# EasyEDA Pro project 农装_2025-08-27.epro, board PCB3_2
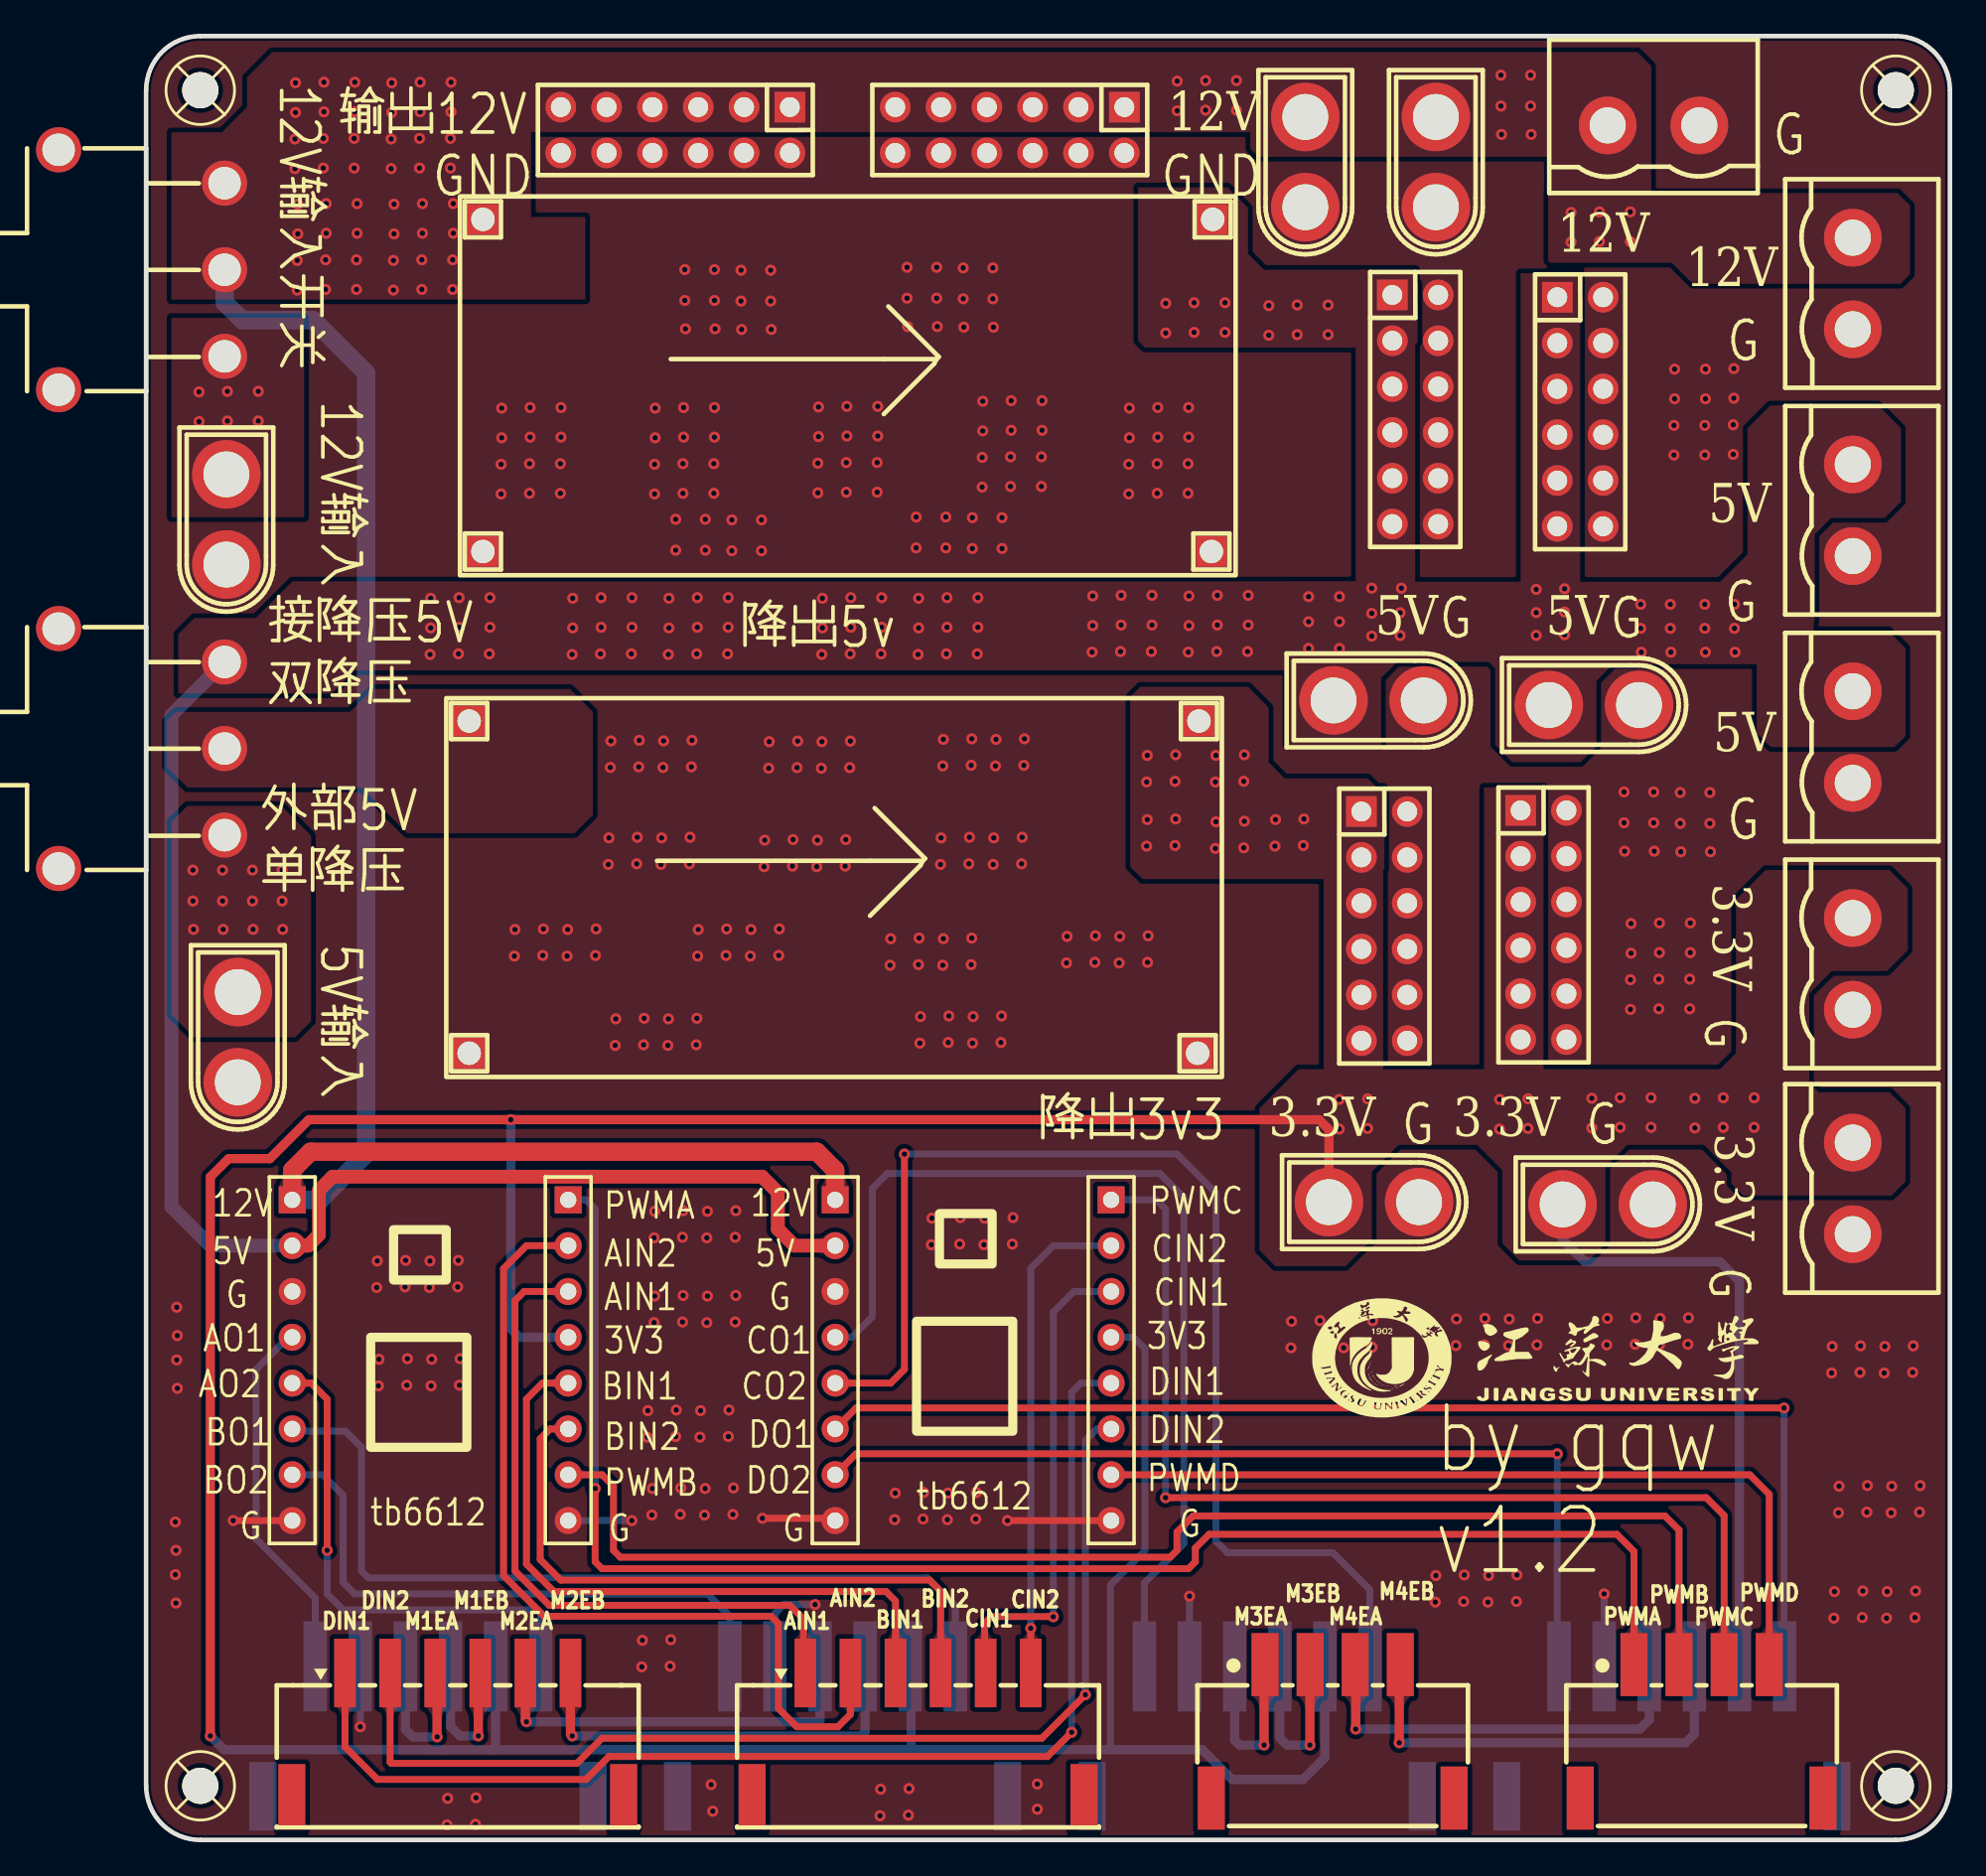
[diagram p4: board, top side]
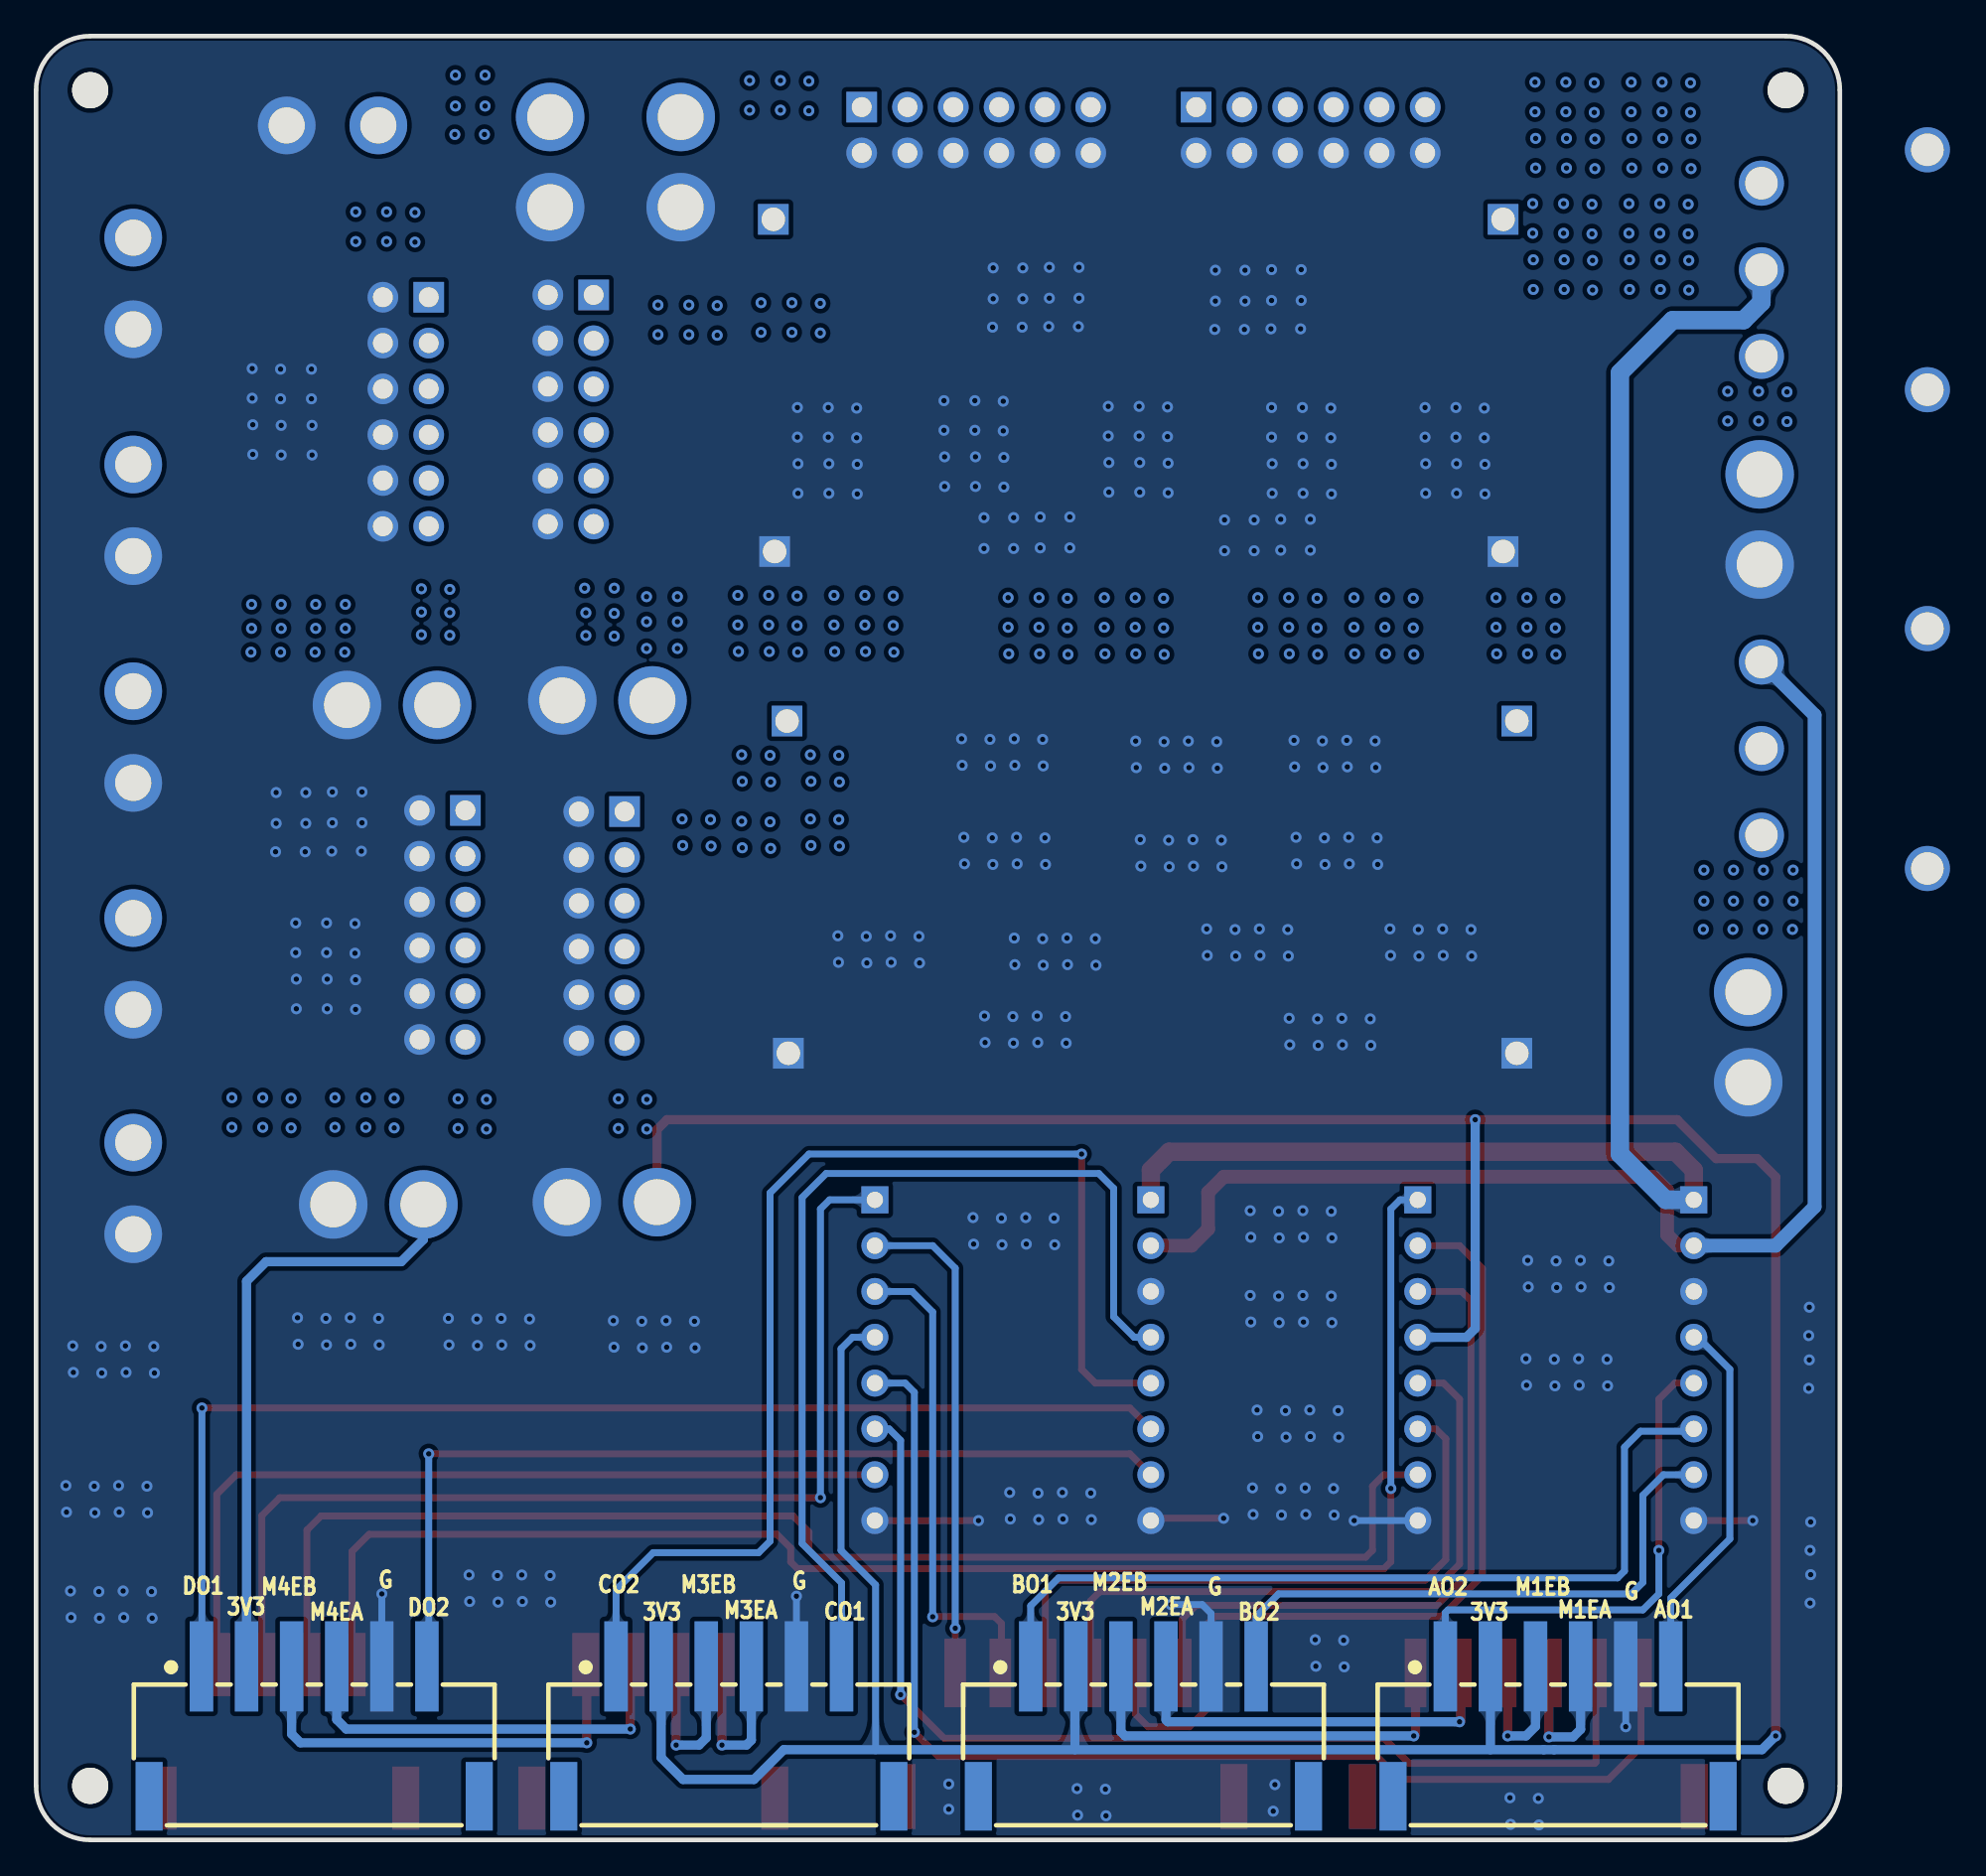
[diagram p5: board, bottom side, seen from below]

Outline 100 x 100 mm; copper layers: Top Layer, Bottom Layer. Coordinates in mm from the lower left corner of the outline.
Outline path: 0,97 0,3 arc(0.88,0.88) 3,0 97,0 arc(99.12,0.88) 100,3 100,97 arc(99.12,99.12) 97,100 3,100 arc(0.88,99.12) 0,97
Stack: Top Layer 0.035mm / Dielectric1 1.51mm FR4 er 4.5 / Bottom Layer 0.035mm

## Design rules (mm)
template: 自定义配置
spacing copperThickness1oz (default): track to track 0.102, other pairs 0.152 to 0.3
spacing copperThickness2oz: track to track 0.203, other pairs 0.152 to 0.3
track width copperThickness1oz (default): min 0.127, default 0.381, max 2.54
track width copperThickness2oz: min 0.203, default 0.254, max 2.54
differential pair differentialPair (default): width min 0.127, default 0.254, max 2.54; gap min 0.152, default 0.152
via viaSize (default): diameter min 0.5, default 0.61, max 10; hole min 0.3, default 0.305, max 6.299

## Placement (name value [footprint] x y rotation side)
CN1  XT30U-M  [CONN-TH_XT30U-M]  4.44 73.2 270 top
CN3  XT30U-M  [CONN-TH_XT30U-M]  5.08 44.5 270 top
CN16  WAFER-XH2.54-4PWB  [CONN-TH_4P-P0.20_XUNPU_WAFER-XH2.54-4PWB]  86.23 6.02 0 top
CN49  DB2EVC-5.08-2P-GN  [CONN-TH_2P-P5.08_DB2EVC-5.08-2P]  94.62 73.71 90 top
CN50  DB2EVC-5.08-2P-GN  [CONN-TH_2P-P5.08_DB2EVC-5.08-2P]  94.62 36.12 90 top
CN51  XT30U-M  [CONN-TH_XT30U-M]  64.26 93.02 270 top
CN52  XT30U-M  [CONN-TH_XT30U-M]  71.5 93.02 270 top
CN53  DB2EVC-5.08-2P-GN  [CONN-TH_2P-P5.08_DB2EVC-5.08-2P]  83.57 95.05 180 top
CN54  DB2EVC-5.08-2P-GN  [CONN-TH_2P-P5.08_DB2EVC-5.08-2P]  94.62 86.28 90 top
CN55  DB2EVC-5.08-2P-GN  [CONN-TH_2P-P5.08_DB2EVC-5.08-2P]  94.62 48.56 90 top
CN56  DB2EVC-5.08-2P-GN  [CONN-TH_2P-P5.08_DB2EVC-5.08-2P]  94.62 61.14 90 top
CN57  XT30U-M  [CONN-TH_XT30U-M]  68.33 63.17 0 top
CN58  XT30U-M  [CONN-TH_XT30U-M]  80.26 62.92 0 top
CN59  XT30U-M  [CONN-TH_XT30U-M]  68.07 35.36 0 top
CN60  XT30U-M  [CONN-TH_XT30U-M]  81.03 35.23 0 top
CN61  WAFER-XH2.54-4PWB  [CONN-TH_4P-P0.20_XUNPU_WAFER-XH2.54-4PWB]  65.78 6.02 0 top
P1  双排针2.54mm2*6排针  [HDR-TH_12P-P2.54-V-M-R2-C6-S2.54]  79.5 79.17 270 top
P2  双排针2.54mm2*6排针  [HDR-TH_12P-P2.54-V-M-R2-C6-S2.54]  68.64 50.66 270 top
P3  双排针2.54mm2*6排针  [HDR-TH_12P-P2.54-V-M-R2-C6-S2.54]  29.34 94.79 180 top
P4  双排针2.54mm2*6排针  [HDR-TH_12P-P2.54-V-M-R2-C6-S2.54]  47.88 94.79 180 top
P5  双排针2.54mm2*6排针  [HDR-TH_12P-P2.54-V-M-R2-C6-S2.54]  70.36 79.3 270 top
P6  双排针2.54mm2*6排针  [HDR-TH_12P-P2.54-V-M-R2-C6-S2.54]  77.47 50.72 270 top
SCREW1  -  [M2螺丝]  97 3 0 top
SCREW2  -  [M2螺丝]  3 3 0 top
SCREW3  -  [M2螺丝]  97 97 0 top
SCREW4  -  [M2螺丝]  3 97 0 top
SW1  SS-12D11L5  [SW-TH_SS-12D11L5]  -0.25 87.05 90 top
SW2  SS-12D11L5  [SW-TH_SS-12D11L5]  -0.25 60.5 90 top
TB1  TB6612  [tb6612]  45.85 26.59 0 top
TB2  TB6612  [tb6612]  15.75 26.59 0 top
U2  -  [lm2596s模块]  38.86 82.09 0 top
U3  -  [lm2596s模块]  38.1 54.28 0 top
U6  HX 2.54-6P WT  [CONN-SMD_6P-P2.50_HANXIA_HX-2.54-6P-WT]  84.58 6.02 180 bottom
U11  2.54-6PWT  [COMM-SMD_6P-P2.50_SHOUHAN_2.54-6PWT]  42.79 5.83 0 top
U28  HX 2.54-6P WT  [CONN-SMD_6P-P2.50_HANXIA_HX-2.54-6P-WT]  61.59 6.02 180 bottom
U32  HX 2.54-6P WT  [CONN-SMD_6P-P2.50_HANXIA_HX-2.54-6P-WT]  15.62 6.02 180 bottom
U33  HX 2.54-6P WT  [CONN-SMD_6P-P2.50_HANXIA_HX-2.54-6P-WT]  38.61 6.02 180 bottom
U34  2.54-6PWT  [COMM-SMD_6P-P2.50_SHOUHAN_2.54-6PWT]  17.27 5.83 0 top

## Footprints (pads in the part's own frame, mm; a bottom-side part is the same pattern mirrored in y, then rotated)
COMM-SMD_6P-P2.50_SHOUHAN_2.54-6PWT
  rect 1.2x3.8 smd: 1(-6.25,3.425) 2(-3.75,3.425) 3(-1.25,3.425) 4(1.25,3.425) 5(3.75,3.425) 6(6.25,3.425)
  rect 1.5x3.6 smd: 7(9.2,-3.425) 8(-9.2,-3.425)
CONN-SMD_6P-P2.50_HANXIA_HX-2.54-6P-WT
  rect 1.3x5 smd: 1(-6.25,3.6) 2(-3.75,3.6) 3(-1.25,3.6) 4(1.25,3.6) 5(3.75,3.6) 6(6.25,3.6)
  rect 1.5x3.8 smd: 7(-9.15,-3.6) 8(9.15,-3.6)
CONN-TH_2P-P5.08_DB2EVC-5.08-2P
  round 3.2 hole 2: 1(-2.54,0) 2(2.54,0)
CONN-TH_4P-P0.20_XUNPU_WAFER-XH2.54-4PWB
  rect 1.5x3.5 smd: 1(-3.75,3.7) 2(-1.25,3.7) 3(1.25,3.7) 4(3.75,3.7) 5(-6.73,-3.7) 6(6.73,-3.7)
CONN-TH_XT30U-M
  round 3.8 hole 2.54: 1(-2.5,0) 2(2.5,0)
HDR-TH_12P-P2.54-V-M-R2-C6-S2.54
  rect 1.7x1.7 hole 1.1: 1(-6.35,-1.27)
  round 1.7 hole 1.1: 2(-6.35,1.27) 3(-3.81,-1.27) 4(-3.81,1.27) 5(-1.27,-1.27) 6(-1.27,1.27) 7(1.27,-1.27) 8(1.27,1.27) 9(3.81,-1.27) 10(3.81,1.27) 11(6.35,-1.27) 12(6.35,1.27)
lm2596s模块
  rect 1.7x1.7 hole 1.3: 1(-20.193,7.747) 2(-20.193,-10.668) 3(20.266,7.747) 4(20.193,-10.668)
M2螺丝
  round 2 hole 2: 1(0,0)
SW-TH_SS-12D11L5
  round 2.5 hole 1.8: 1(-4.8,-4.6) 2(0,-4.6) 3(4.8,-4.6) 4(-6.65,4.6) 5(6.65,4.6)
tb6612
  rect 1.5x1.5 hole 0.9: 1(-7.65,8.89) 2(7.65,8.89)
  round 1.5 hole 0.9: 3(-7.65,6.35) 4(7.65,6.35) 5(-7.65,3.81) 6(7.65,3.81) 7(-7.65,1.27) 8(7.65,1.27) 9(-7.65,-1.27) 10(7.65,-1.27) 11(-7.65,-3.81) 12(7.65,-3.81) 13(-7.65,-6.35) 14(7.65,-6.35) 15(-7.65,-8.89) 16(7.65,-8.89)

## Nets
3V3: CN50.2 CN55.2 CN59.1 CN60.1 P2.1 P2.3 P2.5 P2.7 P2.9 P2.11 P6.1 P6.3 P6.5 P6.7 P6.9 P6.11 TB1.8 TB2.8 U3.3 U6.2 U28.2 U32.2 U33.2
5V: CN49.2 CN56.2 CN57.1 CN58.1 P1.1 P1.3 P1.5 P1.7 P1.9 P1.11 P5.1 P5.3 P5.5 P5.7 P5.9 P5.11 SW2.3 TB1.3 TB2.3 U2.3
12V: CN51.1 CN52.1 CN53.2 CN54.2 P3.1 P3.3 P3.5 P3.7 P3.9 P3.11 P4.1 P4.3 P4.5 P4.7 P4.9 P4.11 SW1.2 SW1.3 TB1.1 TB2.1 U2.1
GND: CN1.2 CN3.2 CN49.1 CN50.1 CN51.2 CN52.2 CN53.1 CN54.1 CN55.1 CN56.1 CN57.2 CN58.2 CN59.2 CN60.2 P1.2 P1.4 P1.6 P1.8 P1.10 P1.12 P2.2 P2.4 P2.6 P2.8 P2.10 P2.12 P3.2 P3.4 P3.6 P3.8 P3.10 P3.12 P4.2 P4.4 P4.6 P4.8 P4.10 P4.12 P5.2 P5.4 P5.6 P5.8 P5.10 P5.12 P6.2 P6.4 P6.6 P6.8 P6.10 P6.12 TB1.5 TB1.15 TB1.16 TB2.5 TB2.15 TB2.16 U2.2 U2.4 U3.2 U3.4 U6.5 U28.5 U32.5 U33.5
AIN1: TB2.6 U11.1
AIN2: TB2.4 U11.2
AO1: TB2.7 U32.6
AO2: TB2.9 U32.1
BIN1: TB2.10 U11.3
BIN2: TB2.12 U11.4
BO1: TB2.11 U33.1
BO2: TB2.13 U33.6
CIN1: TB1.6 U11.5
CIN2: TB1.4 U11.6
CO1: TB1.7 U28.6
CO2: TB1.9 U28.1
DIN1: TB1.10 U34.1
DIN2: TB1.12 U34.2
DO1: TB1.11 U6.1
DO2: TB1.13 U6.6
M1_ENCODER_A: U32.4 U34.3
M1_ENCODER_B: U32.3 U34.4
M2_ENCODER_A: U33.4 U34.5
M2_ENCODER_B: U33.3 U34.6
M3_ENCODER_A: CN61.1 U28.4
M3_ENCODER_B: CN61.2 U28.3
M4_ENCODER_A: CN61.3 U6.4
M4_ENCODER_B: CN61.4 U6.3
PWMA: CN16.1 TB2.2
PWMB: CN16.2 TB2.14
PWMC: CN16.3 TB1.2
PWMD: CN16.4 TB1.14
$1N1529: CN1.1 SW1.1
$1N4066: CN3.1 SW2.1
$1N4071: SW2.2 U3.1

Pads without a net: CN16 5 6; CN61 5 6; SCREW1 1; SCREW2 1; SCREW3 1; SCREW4 1; SW1 4 5; SW2 4 5; U6 7 8; U11 7 8; U28 7 8; U32 7 8; U33 7 8; U34 7 8

## Via types
v1: diameter 0.61, hole 0.305, Top Layer to Bottom Layer, 633 vias

## Routing (per net, layer and track width the routed paths; a pad name or vN(x,y) marks a point on that pad's centre or on a via; arc(x,y) is an arc through that point)
3V3: length 250.4
  Top Layer w0.508: v1(3.56,5.77) 3.56,36.75 4.57,37.77 6.86,37.77 9.02,39.93 65.02,39.93 65.57,39.38 CN59.1
  Bottom Layer w0.381: 53.46,5 53.46,14.14 55.37,16.05 55.37,27.23 54.74,27.86 TB1.8
  Bottom Layer w0.508: 19.37,5 16.43,5 16.42,5 15.83,5 15.83,5 4.32,5 v1(3.56,5.77) ; 19.37,5 U32.2 ; 19.37,5 42.41,5 ; TB2.8 20.7,27.86 20.22,28.35 v1(20.22,39.93) ; U6.2 88.33,30.97 87.25,32.06 79.76,32.06 78.53,33.28 CN60.1 ; U28.2 65.34,4.56 64.13,3.35 60.2,3.35 58.55,5 42.41,5 ; 42.41,5 42.41,9.57 U33.2
  vias: v1(55.5,60.12) v1(55.47,58.65) v1(55.5,56.57) v1(55.47,55.09) v1(57.04,58.68) v1(57.04,55.13) v1(57.07,60.16) v1(57.07,56.6) v1(59.31,60.12) v1(59.28,58.65) v1(59.31,56.44) v1(59.28,54.97) v1(60.85,58.68) v1(60.85,55) v1(60.88,60.16) v1(60.88,56.47) v1(62.61,56.57) v1(62.58,55.09) v1(64.19,56.6) v1(64.15,55.13) v1(66.14,41.05) v1(66.14,39.41) v1(67.72,41.09) v1(67.72,39.44) v1(75.03,41.05) v1(75.03,39.41) v1(76.61,41.09) v1(76.61,39.44) v1(80.15,41.11) v1(80.15,39.47) v1(81.72,41.15) v1(81.72,39.5) v1(83.43,41.15) v1(83.43,39.5) v1(85.86,41.11) v1(85.86,39.47) v1(87.43,41.15) v1(87.43,39.5) v1(89.15,41.15) v1(89.15,39.5)
5V: length 74.9
  Top Layer w0.762: TB2.3 8.97,32.94 9.57,33.55 9.57,36.01 10.34,36.77 34.15,36.77 35.02,35.9 35.02,33.86 35.94,32.94 TB1.3
  Bottom Layer w0.762: SW2.3 1.4,62.35 1.4,35.1 3.56,32.94 TB2.3
  vias: v1(15.74,65.72) v1(15.77,68.83) v1(15.77,67.19) v1(17.35,68.87) v1(17.35,67.22) v1(17.31,65.75) v1(19.03,65.75) v1(19.06,68.87) v1(19.06,67.22) v1(23.65,68.83) v1(23.65,67.19) v1(23.61,65.72) v1(25.22,68.87) v1(25.22,67.22) v1(25.19,65.75) v1(26.93,68.87) v1(26.93,67.22) v1(26.9,65.75) v1(28.95,65.72) v1(28.98,68.83) v1(28.98,67.19) v1(30.52,65.75) v1(30.56,68.87) v1(30.56,67.22) v1(32.23,65.75) v1(32.27,68.87) v1(32.27,67.22) v1(37.49,68.83) v1(37.49,67.19) v1(37.46,65.72) v1(39.03,65.75) v1(39.06,68.87) v1(39.06,67.22) v1(40.74,65.75) v1(40.78,68.87) v1(40.78,67.22) v1(42.82,68.83) v1(42.82,67.19) v1(42.79,65.72) v1(44.4,68.87) v1(44.4,67.22) v1(44.36,65.75) v1(46.11,68.87) v1(46.11,67.22) v1(46.08,65.75) v1(52.44,65.85) v1(52.48,68.96) v1(52.48,67.32) v1(54.02,65.88) v1(54.05,69) v1(54.05,67.35) v1(55.73,65.88) v1(55.76,69) v1(55.76,67.35) v1(56.52,85.18) v1(56.52,83.54) v1(57.81,68.96) v1(57.81,67.32) v1(57.78,65.85) v1(58.1,85.22) v1(58.1,83.57) v1(59.38,69) v1(59.38,67.35) v1(59.35,65.88) v1(59.81,85.22) v1(59.81,83.57) v1(61.1,69) v1(61.1,67.35) v1(61.06,65.88) v1(62.24,85.06) v1(62.24,83.41) v1(63.81,85.09) v1(63.81,83.45) v1(64.44,68.92) v1(64.44,67.53) v1(64.44,66.05) v1(65.52,85.09) v1(65.52,83.45) v1(66.16,68.92) v1(66.16,67.53) v1(66.16,66.05) v1(67.94,69.39) v1(67.94,68) v1(67.94,66.73) v1(69.52,68.03) v1(69.52,66.77) v1(69.59,69.39) v1(77.06,69.33) v1(77.06,68.04) v1(77.06,66.78) v1(78.64,69.36) v1(78.64,68.07) v1(78.64,66.81) v1(82.85,68.5) v1(82.85,67.17) v1(82.89,65.85) v1(84.5,68.5) v1(84.5,67.17) v1(84.53,65.85) v1(86.41,68.5) v1(86.41,67.17) v1(86.44,65.85) v1(88.05,68.5) v1(88.05,67.17) v1(88.09,65.85)
12V: length 94
  Top Layer w1.016: TB2.1 8.1,37.14 9.11,38.15 37.18,38.15 38.2,37.14 TB1.1
  Bottom Layer w1.016: SW1.2 4.35,85.24 5.33,84.25 9.27,84.25 12.19,81.33 12.19,38.02 9.65,35.48 TB2.1
  vias: v1(8.25,94.29) v1(8.25,92.65) v1(8.28,97.41) v1(8.28,95.77) v1(8.41,90.68) v1(8.41,89.03) v1(8.37,87.56) v1(8.37,85.92) v1(9.82,94.33) v1(9.82,92.68) v1(9.85,97.44) v1(9.85,95.8) v1(9.95,87.6) v1(9.95,85.95) v1(9.98,90.71) v1(9.98,89.07) v1(11.53,94.33) v1(11.53,92.68) v1(11.57,97.44) v1(11.57,95.8) v1(11.69,90.71) v1(11.69,89.07) v1(11.66,87.6) v1(11.66,85.95) v1(13.61,97.41) v1(13.61,95.77) v1(13.58,94.29) v1(13.58,92.65) v1(13.74,90.68) v1(13.74,89.03) v1(13.71,87.56) v1(13.71,85.92) v1(15.19,97.44) v1(15.19,95.8) v1(15.15,94.33) v1(15.15,92.68) v1(15.31,90.71) v1(15.31,89.07) v1(15.28,87.6) v1(15.28,85.95) v1(16.9,97.44) v1(16.9,95.8) v1(16.87,94.33) v1(16.87,92.68) v1(17.03,90.71) v1(17.03,89.07) v1(16.99,87.6) v1(16.99,85.95) v1(57.16,97.5) v1(57.16,95.86) v1(58.73,97.54) v1(58.73,95.89) v1(60.44,97.54) v1(60.44,95.89) v1(75.11,97.83) v1(75.11,96.12) v1(75.14,94.55) v1(76.75,97.83) v1(76.75,96.12) v1(76.78,94.55) v1(78.99,90.22) v1(78.99,88.58) v1(80.57,90.25) v1(80.57,88.61) v1(82.28,90.25) v1(82.28,88.61)
GND: length 33.3
  Top Layer w0.381: v1(34.16,17.83) 38.07,17.83 TB1.15 ; TB1.16 v1(47.75,17.7) ; TB2.15 v1(4.83,17.7)
  Bottom Layer w0.381: U32.5 v1(11.87,6.27) ; U28.5 v1(57.84,13.51) ; U33.5 34.86,12.56 35.35,13.05 v1(37.08,13.05) ; U6.5 v1(80.83,13.64) ; TB2.16 v1(26.92,17.7)
  vias: v1(1.62,17.63) v1(1.62,14.71) v1(1.69,29.53) v1(1.73,27.96) v1(1.69,26.61) v1(1.73,25.04) v1(1.65,16.05) v1(1.65,13.13) v1(12.81,32.1) v1(12.78,30.62) v1(12.91,26.65) v1(12.87,25.17) v1(14.38,32.13) v1(14.35,30.66) v1(14.45,25.21) v1(14.48,26.68) v1(15.73,32.1) v1(15.7,30.62) v1(15.83,26.65) v1(15.8,25.17) v1(16.71,2.3) v1(16.68,0.83) v1(17.31,32.13) v1(17.27,30.66) v1(17.4,26.68) v1(17.37,25.21) v1(18.29,2.34) v1(18.25,0.87) v1(19.71,79.38) v1(19.71,77.73) v1(19.68,76.26) v1(19.68,74.62) v1(20.45,50.47) v1(20.41,49) v1(21.28,79.41) v1(21.28,77.77) v1(21.25,76.29) v1(21.25,74.65) v1(22.02,50.5) v1(21.99,49.03) v1(23,79.41) v1(23,77.77) v1(22.96,76.29) v1(22.96,74.65) v1(23.33,49) v1(23.37,50.47) v1(24.94,50.5) v1(24.91,49.03) v1(25.62,54.08) v1(25.73,59.45) v1(25.65,55.55) v1(25.76,60.92) v1(26.03,45.52) v1(26,44.05) v1(27.23,55.58) v1(27.19,54.11) v1(27.34,60.96) v1(27.31,59.49) v1(27.51,11.07) v1(27.48,9.59) v1(27.61,45.55) v1(27.58,44.08) v1(27.81,23.8) v1(27.78,22.33) v1(28.03,18.01) v1(28.07,19.48) v1(28.22,79.38) v1(28.22,77.73) v1(28.19,76.26) v1(28.19,74.62) v1(28.19,34.85) v1(28.16,33.38) v1(28.19,30.15) v1(28.16,28.68) v1(28.54,54.08) v1(28.57,55.55) v1(28.69,60.92) v1(28.65,59.45) v1(28.92,44.05) v1(28.96,45.52) v1(29.05,9.63) v1(29.08,11.1) v1(29.35,73.21) v1(29.35,71.5) v1(29.39,23.83) v1(29.35,22.36) v1(29.64,19.52) v1(29.61,18.04) v1(29.73,33.41) v1(29.73,28.71) v1(29.79,79.41) v1(29.79,77.77) v1(29.76,76.29) v1(29.76,74.65) v1(29.77,34.88) v1(29.77,30.18) v1(29.86,87.05) v1(29.86,85.34) v1(29.9,83.77) v1(30.15,55.58) v1(30.12,54.11) v1(30.23,59.49) v1(30.26,60.96) v1(30.53,45.55) v1(30.5,44.08) v1(30.61,50.47) v1(30.57,49) v1(30.73,23.8) v1(30.7,22.33) v1(31,73.21) v1(31,71.5) v1(30.99,19.48) v1(30.95,18.01) v1(31.12,34.85) v1(31.08,33.38) v1(31.12,30.15) v1(31.08,28.68) v1(31.32,3.07) v1(31.41,1.59) v1(31.5,87.05) v1(31.5,85.34) v1(31.54,83.77) v1(31.5,79.41) v1(31.5,77.77) v1(31.47,76.29) v1(31.47,74.65) v1(32.15,49.03) v1(32.18,50.5) v1(32.31,23.83) v1(32.27,22.36) v1(32.47,73.18) v1(32.47,71.47) v1(32.53,18.04) v1(32.56,19.52) v1(32.69,34.88) v1(32.66,33.41) v1(32.69,30.18) v1(32.66,28.71) v1(32.98,87.02) v1(32.98,85.31) v1(33.01,83.74) v1(33.53,50.47) v1(33.49,49) v1(34.11,73.18) v1(34.11,71.47) v1(34.29,55.42) v1(34.26,53.95) v1(34.54,60.88) v1(34.51,59.41) v1(34.62,87.02) v1(34.62,85.31) v1(34.65,83.74) v1(35.1,50.5) v1(35.07,49.03) v1(35.83,53.98) v1(35.86,55.46) v1(36.12,60.92) v1(36.08,59.45) v1(37.24,76.32) v1(37.24,74.68) v1(37.21,55.42) v1(37.18,53.95) v1(37.27,79.44) v1(37.27,77.8) v1(37.43,59.41) v1(37.47,60.88) v1(38.85,79.47) v1(38.85,77.83) v1(38.81,76.36) v1(38.81,74.71) v1(38.78,55.46) v1(38.75,53.98) v1(39.04,60.92) v1(39.01,59.45) v1(40.53,76.36) v1(40.53,74.71) v1(40.56,79.47) v1(40.56,77.83) v1(40.72,2.81) v1(40.68,1.34) v1(41.24,48.49) v1(41.28,49.96) v1(41.53,19.23) v1(41.5,17.76) v1(42.18,87.18) v1(42.18,85.47) v1(42.21,83.9) v1(42.29,2.84) v1(42.26,1.37) v1(42.69,73.34) v1(42.69,71.63) v1(42.85,50) v1(42.82,48.52) v1(42.93,45.64) v1(42.89,44.17) v1(43.1,19.26) v1(43.07,17.79) v1(43.53,33) v1(43.56,34.47) v1(43.82,87.18) v1(43.82,85.47) v1(43.86,83.9) v1(44.04,54.08) v1(44.07,55.55) v1(44.2,61.01) v1(44.16,59.54) v1(44.2,49.96) v1(44.16,48.49) v1(44.33,73.34) v1(44.33,71.63) v1(44.45,19.23) v1(44.42,17.76) v1(44.5,45.68) v1(44.47,44.21) v1(45.13,34.5) v1(45.1,33.03) v1(45.3,87.15) v1(45.3,85.44) v1(45.33,83.86) v1(45.64,55.58) v1(45.61,54.11) v1(45.74,59.57) v1(45.74,48.52) v1(45.8,73.31) v1(45.8,71.59) v1(45.77,61.04) v1(45.77,50) v1(45.85,45.64) v1(45.81,44.17) v1(46.02,19.26) v1(45.99,17.79) v1(46.35,76.64) v1(46.35,75) v1(46.38,79.76) v1(46.38,78.11) v1(46.45,33) v1(46.48,34.47) v1(46.94,87.15) v1(46.94,85.44) v1(46.97,83.86) v1(46.99,55.55) v1(46.96,54.08) v1(47.12,61.01) v1(47.08,59.54) v1(47.45,73.31) v1(47.45,71.59) v1(47.42,45.68) v1(47.39,44.21) v1(47.92,76.67) v1(47.92,75.03) v1(47.95,79.79) v1(47.95,78.15) v1(48.02,33.03) v1(48.06,34.5) v1(48.53,54.11) v1(48.56,55.58) v1(48.69,61.04) v1(48.66,59.57) v1(49.4,3.1) v1(49.4,1.7) v1(49.63,76.67) v1(49.63,75.03) v1(49.67,79.79) v1(49.67,78.15) v1(51.02,48.62) v1(51.05,50.09) v1(52.63,50.12) v1(52.59,48.65) v1(53.94,48.62) v1(53.97,50.09) v1(54.51,79.38) v1(54.51,77.73) v1(54.47,76.26) v1(54.47,74.62) v1(55.55,50.12) v1(55.52,48.65) v1(56.05,76.29) v1(56.05,74.65) v1(56.08,79.41) v1(56.08,77.77) v1(57.79,79.41) v1(57.79,77.77) v1(57.76,76.29) v1(57.76,74.65) v1(63.5,28.75) v1(63.47,27.28) v1(65.04,27.31) v1(65.07,28.79) v1(66.42,28.75) v1(66.39,27.28) v1(68,28.79) v1(67.96,27.31) v1(71.5,14.66) v1(71.47,13.18) v1(72.64,28.88) v1(72.61,27.41) v1(73.04,13.22) v1(73.07,14.69) v1(74.22,28.91) v1(74.18,27.44) v1(74.42,14.66) v1(74.39,13.18) v1(75.53,27.41) v1(75.56,28.88) v1(76,14.69) v1(75.96,13.22) v1(77.14,28.91) v1(77.11,27.44) v1(81.01,28.91) v1(80.98,27.44) v1(81.93,58.1) v1(81.93,56.39) v1(81.97,54.81) v1(82.32,50.8) v1(82.32,49.16) v1(82.29,47.69) v1(82.29,46.04) v1(82.58,28.95) v1(82.55,27.48) v1(83.57,58.1) v1(83.57,56.39) v1(83.61,54.81) v1(83.9,50.83) v1(83.9,49.19) v1(83.86,47.72) v1(83.86,46.08) v1(83.93,28.91) v1(83.9,27.44) v1(84.73,81.53) v1(84.73,79.89) v1(84.7,78.42) v1(84.7,76.78) v1(85.05,58.06) v1(85.05,56.35) v1(85.08,54.78) v1(85.51,28.95) v1(85.47,27.48) v1(85.61,50.83) v1(85.61,49.19) v1(85.57,47.72) v1(85.57,46.08) v1(86.45,81.53) v1(86.45,79.89) v1(86.41,78.42) v1(86.41,76.78) v1(86.69,58.06) v1(86.69,56.35) v1(86.72,54.78) v1(88.02,81.57) v1(88.02,79.92) v1(87.99,78.45) v1(87.99,76.81) v1(93.44,25.88) v1(93.47,27.36) v1(93.6,13.77) v1(93.57,12.29) v1(93.82,18.14) v1(93.85,19.61) v1(95.05,27.39) v1(95.01,25.92) v1(95.14,12.33) v1(95.17,13.8) v1(95.43,19.64) v1(95.39,18.17) v1(96.39,27.36) v1(96.36,25.88) v1(96.52,13.77) v1(96.49,12.29) v1(96.74,18.14) v1(96.77,19.61) v1(97.93,25.92) v1(97.97,27.39) v1(98.09,13.8) v1(98.06,12.33) v1(98.35,19.64) v1(98.31,18.17)
AIN1: length 38.3
  Top Layer w0.381: TB2.6 20.95,30.4 20.45,29.9 20.45,14.91 22.35,13 35.69,13 36.45,12.24 36.45,9.35 U11.1
AIN2: length 49.2
  Top Layer w0.381: U11.2 39.04,6.96 38.35,6.27 36.07,6.27 35.05,7.29 35.05,11.99 34.64,12.4 22.07,12.4 19.81,14.66 19.81,31.67 21.08,32.94 TB2.4
AO1: length 20.6
  Bottom Layer w0.381: TB2.7 7.87,27.86 6.1,26.09 6.1,16.69 9.37,13.41 U32.6
AO2: length 28.3
  Top Layer w0.381: TB2.9 9.14,25.32 10.03,24.44 v1(10.03,16.05)
  Bottom Layer w0.381: v1(10.03,16.05) 10.03,13.64 10.92,12.75 21.72,12.75 21.87,12.6 U32.1
BIN1: length 37.1
  Top Layer w0.381: TB2.10 21.97,25.32 21.08,24.44 21.08,15.29 22.61,13.77 41.02,13.77 41.54,13.25 U11.3
BIN2: length 35.9
  Top Layer w0.381: TB2.12 22.39,22.78 21.84,22.23 21.84,15.54 22.99,14.4 43.43,14.4 44.04,13.79 U11.4
BO1: length 48.2
  Bottom Layer w0.381: U33.1 44.86,12.98 43.31,14.53 12.32,14.53 11.94,14.91 11.94,21.77 11.05,22.66 8.22,22.66 TB2.11
BO2: length 33.1
  Bottom Layer w0.381: U33.6 32.36,12.4 31.12,13.64 11.56,13.64 10.92,14.28 10.92,19.1 9.78,20.24 TB2.13
CIN1: length 27.3
  Top Layer w0.381: v1(50.29,12.37) 50.28,12.38 46.86,12.38 46.48,12 46.48,9.31 U11.5
  Bottom Layer w0.381: TB1.6 51.44,30.4 50.29,29.26 v1(50.29,12.37)
CIN2: length 27.4
  Top Layer w0.381: U11.6 v1(49.04,11.74)
  Bottom Layer w0.381: TB1.4 50.29,32.94 49.04,31.69 v1(49.04,11.74)
CO1: length 54.7
  Bottom Layer w0.381: TB1.7 39.12,27.86 40.26,29.01 40.26,36.12 41.08,36.94 56.2,36.94 57.53,35.61 57.53,16.43 55.34,14.25 U28.6
CO2: length 67.5
  Top Layer w0.381: v1(42.04,38.02) 42.04,26.09 41.28,25.32 TB1.9
  Bottom Layer w0.381: U28.1 67.84,13.87 65.79,15.93 59.94,15.93 59.31,16.56 59.31,35.86 57.15,38.02 v1(42.04,38.02)
DIN1: length 67.5
  Top Layer w0.381: v1(51.31,5.97) 49.96,4.62 25.65,4.62 24.38,3.35 12.83,3.35 11.02,5.16 U34.1
  Bottom Layer w0.381: TB1.10 51.82,25.32 51.31,24.82 v1(51.31,5.97)
DIN2: length 60.9
  Top Layer w0.381: v1(52.07,8.05) 49.66,5.64 25.27,5.64 23.88,4.24 13.59,4.24 13.52,4.31 U34.2
  Bottom Layer w0.381: TB1.12 52.71,22.78 52.07,22.15 v1(52.07,8.05)
DO1: length 67.4
  Top Layer w0.381: v1(90.81,23.94) 39.36,23.94 TB1.11
  Bottom Layer w0.381: U6.1 90.81,9.65 v1(90.81,23.94)
DO2: length 52.3
  Top Layer w0.381: TB1.13 39.36,21.41 v1(78.23,21.41)
  Bottom Layer w0.381: U6.6 78.23,9.72 v1(78.23,21.41)
M1_ENCODER_A: length 9
  Top Layer w0.508: v1(16.13,5.71) 16.13,9.15 U34.3
  Bottom Layer w0.508: v1(16.13,5.71) 14.79,5.71 14.37,6.13 U32.4
M1_ENCODER_B: length 8.6
  Top Layer w0.508: v1(18.42,5.77) 18.42,9.15 U34.4
  Bottom Layer w0.508: U32.3 16.87,6.29 17.4,5.77 v1(18.42,5.77)
M2_ENCODER_A: length 22
  Top Layer w0.508: v1(21.08,6.55) 21.02,6.61 U34.5
  Bottom Layer w0.508: U33.4 37.36,6.66 37.25,6.55 v1(21.08,6.55)
M2_ENCODER_B: length 23.5
  Top Layer w0.508: v1(23.62,5.77) 23.52,5.87 U34.6
  Bottom Layer w0.508: U33.3 39.86,6 39.62,5.77 v1(23.62,5.77)
M3_ENCODER_A: length 10.3
  Top Layer w0.508: v1(61.98,5.26) 61.98,9.67 CN61.1
  Bottom Layer w0.508: U28.4 60.34,5.53 60.62,5.26 v1(61.98,5.26)
M3_ENCODER_B: length 10.3
  Top Layer w0.508: v1(64.52,5.26) 64.52,9.71 CN61.2
  Bottom Layer w0.508: U28.3 62.84,5.66 63.25,5.26 v1(64.52,5.26)
M4_ENCODER_A: length 23
  Top Layer w0.508: CN61.3 67.06,9.69 v1(67.06,6.15)
  Bottom Layer w0.508: U6.4 83.33,6.68 82.8,6.15 v1(67.06,6.15)
M4_ENCODER_B: length 24.7
  Top Layer w0.508: v1(69.47,5.38) 69.47,9.66 CN61.4
  Bottom Layer w0.508: v1(69.47,5.38) 85.34,5.38 85.83,5.87 U6.3
PWMA: length 86.9
  Top Layer w0.381: CN16.1 82.48,15.99 81.53,16.94 58.93,16.94 58.17,16.18 58.17,15.42 57.78,15.04 25.27,15.04 24.89,15.42 v1(24.89,19.48)
  Bottom Layer w0.381: TB2.2 24.38,35.48 24.89,34.98 v1(24.89,19.48)
PWMB: length 74.9
  Top Layer w0.381: TB2.14 25.27,20.24 25.91,19.61 25.91,16.05 26.29,15.67 56.77,15.67 57.15,16.05 57.15,17.07 58.04,17.96 84.2,17.96 84.98,17.18 CN16.2
PWMC: length 58.9
  Top Layer w0.381: CN16.3 87.48,17.98 86.49,18.97 v1(56.51,18.97)
  Bottom Layer w0.381: v1(56.51,18.97) 56.51,34.98 56.01,35.48 TB1.2
PWMD: length 46.4
  Top Layer w0.381: TB1.14 88.9,20.24 89.98,19.16 CN16.4
$1N1529:
  vias: v1(2.93,80.27) v1(2.93,78.63) v1(4.5,80.31) v1(4.5,78.66) v1(6.21,80.31) v1(6.21,78.66)
$1N4066:
  vias: v1(2.59,53.76) v1(2.59,52.05) v1(2.62,50.48) v1(4.23,53.76) v1(4.23,52.05) v1(4.27,50.48) v1(5.89,53.76) v1(5.89,52.05) v1(5.93,50.48) v1(7.54,53.76) v1(7.54,52.05) v1(7.57,50.48)

## Copper pours and planes (outline as drawn; the poured copper is in the pictures)
3V3 on Top Layer: 61.72,53.77 97.66,53.77 97.66,31.8 61.72,31.8
3V3 on Top Layer: 65.28,58.34 68.58,58.34 68.58,38.41 65.28,38.41
3V3 on Top Layer: 74.17,58.34 77.47,58.34 77.47,38.41 74.17,38.41
3V3 on Top Layer: 54.55,63.93 68.64,63.93 68.64,53.26 54.55,53.26
5V on Top Layer: 1.78,69.77 68.47,69.77 68.47,63.55 1.78,63.55
5V on Top Layer: 54.99,91.62 70.49,91.62 70.49,82.73 54.99,82.73
5V on Top Layer: 76.2,86.86 79.5,86.86 79.5,66.28 76.2,66.28
5V on Top Layer: 63.25,79.53 97.54,79.53 97.54,59.75 63.25,59.75
5V on Top Layer: 67.06,87.05 70.36,87.05 70.36,66.34 67.06,66.34
12V on Top Layer: 1.4,99.11 83.44,99.11 83.44,85.39 1.4,85.39
12V on Top Layer: 77.72,91.3 97.79,91.3 97.79,86.27 77.72,86.27
GND on Top Layer: -23.24,109.65 108.46,109.65 108.46,-12.01 -23.24,-12.01
GND on Bottom Layer: -36.58,115.11 126.24,115.11 126.24,-24.97 -36.58,-24.97
$1N1529 on Top Layer: 1.4,84.38 8.76,84.38 8.76,73.33 1.4,73.33
$1N4066 on Top Layer: 1.4,57.33 9.14,57.33 9.14,44.49 1.4,44.49
$1N4071 on Top Layer: 1.14,63.81 24.77,63.81 24.77,55.8 1.14,55.8

Small or netless copper shapes (teardrops, artwork), in the pictures only: 62 on Top Layer, 69 on Bottom Layer

## Text on the board
Bottom Silkscreen Layer: AO1 | G | M1EA | M1EB | 3V3 | AO2 | BO2 | M2EA | M2EB | BO1 | CO1 | M3EA | M3EB | CO2 | DO2 | M4EA | M4EB | DO1
Top Silkscreen Layer: DIN1 | DIN2 | M1EA | M1EB | M2EA | M2EB | AIN1 | AIN2 | BIN1 | BIN2 | CIN1 | CIN2 | M3EA | M3EB | M4EA | M4EB | PWMA | PWMB | PWMC | PWMD | AO2 | AO1 | BO2 | BO1 | 12V | 5V | G | tb6612 | 3V3 | CO2 | DO2 | CO1 | DO1 | GND | by gqw / v1.2 | 输出12V | 降出3v3 | 3.3V | 12V输入开关 | 12V输入 | 5V输入 | 外部5V / 单降压 | 接降压5V / 双降压 | 降出5v
